# Altium schematic sheet atmel.SchDoc
size A4; SheetNumber: 3; SheetTotal: 5
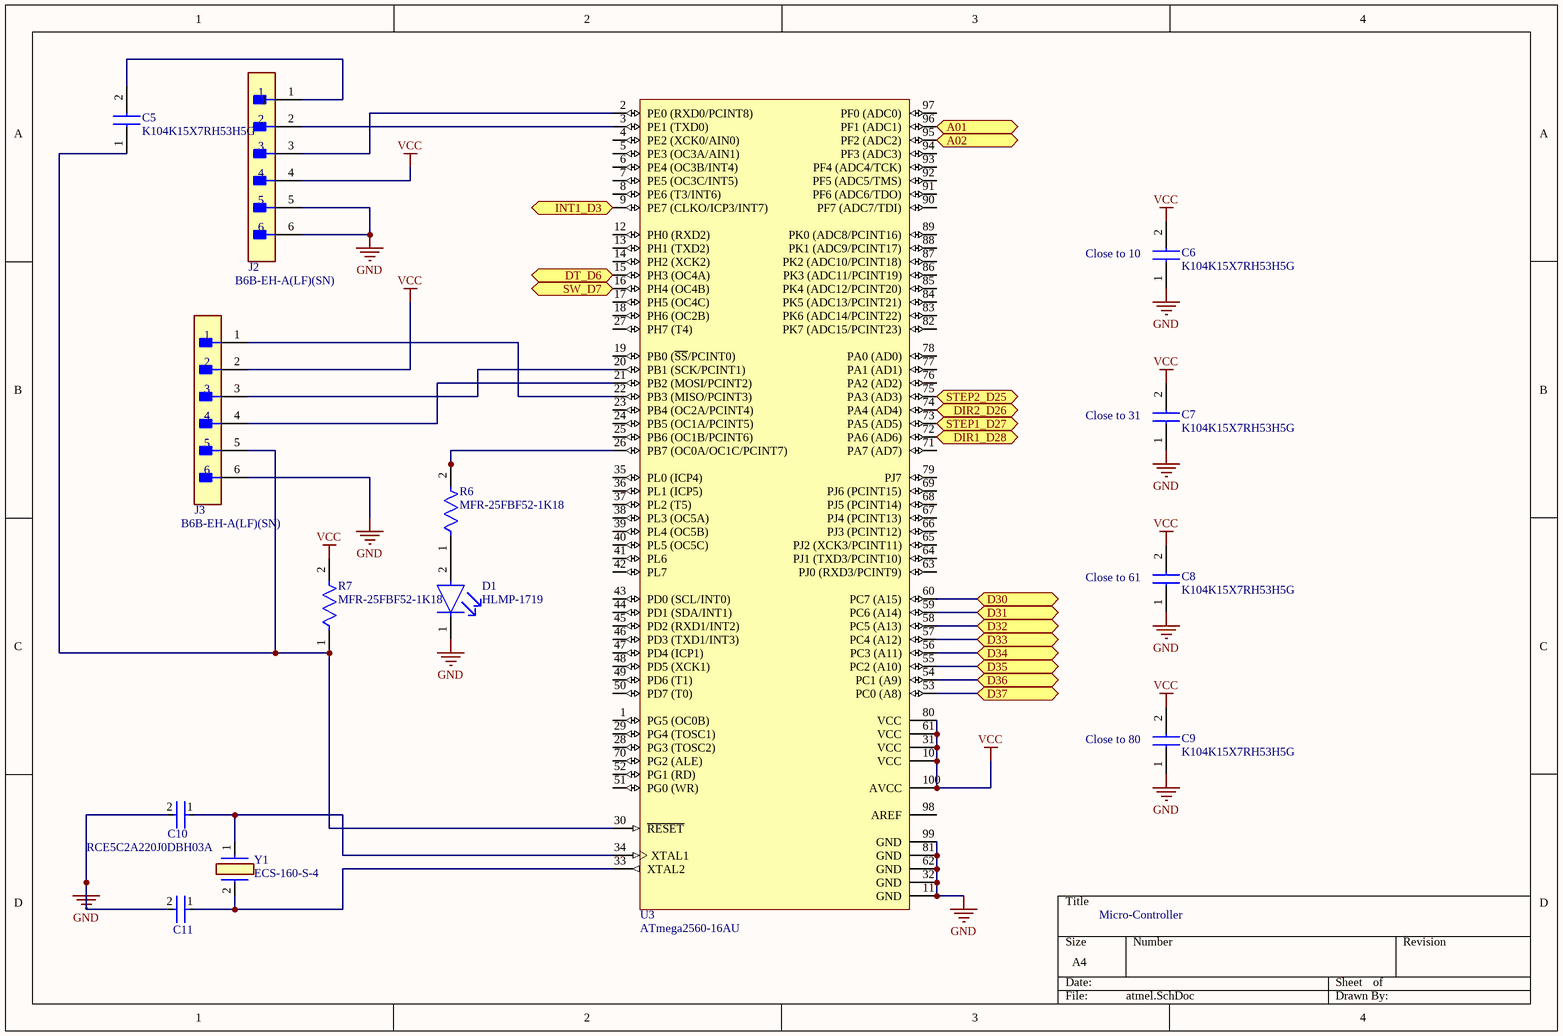
[diagram p0: atmel.SchDoc]

## Parts
C5  K104K15X7RH53H5G  [K104K15X7RH53H5G]
C6  K104K15X7RH53H5G  [K104K15X7RH53H5G]
C7  K104K15X7RH53H5G  [K104K15X7RH53H5G]
C8  K104K15X7RH53H5G  [K104K15X7RH53H5G]
C9  K104K15X7RH53H5G  [K104K15X7RH53H5G]
C10  RCE5C2A220J0DBH03A  [FP-RCE0DB-MFG]
C11  RCE5C2A220J0DBH03A  [FP-RCE0DB-MFG]  (value not drawn)
D1  HLMP-1719  [FP-HLMP-1719-MFG]
J2  B6B-EH-A(LF)(SN)  [FP-B6B-EH-A_LF_SN-MFG]
J3  B6B-EH-A(LF)(SN)  [FP-B6B-EH-A_LF_SN-MFG]
R6  MFR-25FBF52-1K18  [FP-MFR-25-MFG]
R7  MFR-25FBF52-1K18  [FP-MFR-25-MFG]
U3  ATmega2560-16AU  [100A_M]
Y1  ECS-160-S-4  [ECS160S4]

## Ports
A01 (bidir), A02 (bidir), D30 (bidir), D31 (bidir), D32 (bidir), D33 (bidir), D34 (bidir), D35 (bidir), D36 (bidir), D37 (bidir), DIR1_D28 (bidir), DIR2_D26 (bidir), DT_D6 (bidir), INT1_D3 (bidir), STEP1_D27 (bidir), STEP2_D25 (bidir), SW_D7 (bidir)

## Nets
GND: C6.1 C7.1 C8.1 C9.1 C10.2 C11.2 D1.1(C) J2.5 J2.6 J3.6 U3.11(GND) U3.32(GND) U3.62(GND) U3.81(GND) U3.99(GND)
VCC: C6.2 C7.2 C8.2 C9.2 J2.4 J3.2 R7.2 U3.10(VCC) U3.31(VCC) U3.61(VCC) U3.80(VCC) U3.100(AVCC)
A01: U3.96(PF1_(ADC1)) ; port A01
A02: U3.95(PF2_(ADC2)) ; port A02
D30: U3.60(PC7_(A15)) ; port D30
D31: U3.59(PC6_(A14)) ; port D31
D32: U3.58(PC5_(A13)) ; port D32
D33: U3.57(PC4_(A12)) ; port D33
D34: U3.56(PC3_(A11)) ; port D34
D35: U3.55(PC2_(A10)) ; port D35
D36: U3.54(PC1_(A9)) ; port D36
D37: U3.53(PC0_(A8)) ; port D37
DIR1_D28: U3.72(PA6_(AD6)) ; port DIR1_D28
DIR2_D26: U3.74(PA4_(AD4)) ; port DIR2_D26
DT_D6: U3.15(PH3_(OC4A)) ; port DT_D6
INT1_D3: U3.9(PE7_(CLKO/ICP3/INT7)) ; port INT1_D3
STEP1_D27: U3.73(PA5_(AD5)) ; port STEP1_D27
STEP2_D25: U3.75(PA3_(AD3)) ; port STEP2_D25
SW_D7: U3.16(PH4_(OC4B)) ; port SW_D7
NetC5_1: C5.1 J3.5 R7.1 U3.30(~{RESET})
NetC5_2: C5.2 J2.1
NetC10_1: C10.1 U3.34(XTAL1) Y1.1
NetC11_1: C11.1 U3.33(XTAL2) Y1.2
NetD1_2: D1.2(A) R6.1
NetJ2_2: J2.2 U3.3(PE1_(TXD0))
NetJ2_3: J2.3 U3.2(PE0_(RXD0/PCINT8))
NetJ3_1: J3.1 U3.22(PB3_(MISO/PCINT3))
NetJ3_3: J3.3 U3.20(PB1_(SCK/PCINT1))
NetJ3_4: J3.4 U3.21(PB2_(MOSI/PCINT2))
NetR6_2: R6.2 U3.26(PB7_(OC0A/OC1C/PCINT7))

Not connected (* = marked no-connect by the designer): U3 1(PG5_(OC0B)) 4(PE2_(XCK0/AIN0)) 5(PE3_(OC3A/AIN1)) 6(PE4_(OC3B/INT4)) 7(PE5_(OC3C/INT5)) 8(PE6_(T3/INT6)) 12(PH0_(RXD2)) 13(PH1_(TXD2)) 14(PH2_(XCK2)) 17(PH5_(OC4C)) 18(PH6_(OC2B)) 19(PB0_(~{SS}/PCINT0)) 23(PB4_(OC2A/PCINT4)) 24(PB5_(OC1A/PCINT5)) 25(PB6_(OC1B/PCINT6)) 27(PH7_(T4)) 28(PG3_(TOSC2)) 29(PG4_(TOSC1)) 35(PL0_(ICP4)) 36(PL1_(ICP5)) 37(PL2_(T5)) 38(PL3_(OC5A)) 39(PL4_(OC5B)) 40(PL5_(OC5C)) 41(PL6) 42(PL7) 43(PD0_(SCL/INT0)) 44(PD1_(SDA/INT1)) 45(PD2_(RXD1/INT2)) 46(PD3_(TXD1/INT3)) 47(PD4_(ICP1)) 48(PD5_(XCK1)) 49(PD6_(T1)) 50(PD7_(T0)) 51(PG0_(WR)) 52(PG1_(RD)) 63(PJ0_(RXD3/PCINT9)) 64(PJ1_(TXD3/PCINT10)) 65(PJ2_(XCK3/PCINT11)) 66(PJ3_(PCINT12)) 67(PJ4_(PCINT13)) 68(PJ5_(PCINT14)) 69(PJ6_(PCINT15)) 70(PG2_(ALE)) 71(PA7_(AD7)) 76(PA2_(AD2)) 77(PA1_(AD1)) 78(PA0_(AD0)) 79(PJ7) 82(PK7_(ADC15/PCINT23)) 83(PK6_(ADC14/PCINT22)) 84(PK5_(ADC13/PCINT21)) 85(PK4_(ADC12/PCINT20)) 86(PK3_(ADC11/PCINT19)) 87(PK2_(ADC10/PCINT18)) 88(PK1_(ADC9/PCINT17)) 89(PK0_(ADC8/PCINT16)) 90(PF7_(ADC7/TDI)) 91(PF6_(ADC6/TDO)) 92(PF5_(ADC5/TMS)) 93(PF4_(ADC4/TCK)) 94(PF3_(ADC3)) 97(PF0_(ADC0)) 98(AREF)

## Notes on the sheet
- (near C6) Close to 10
- (near C7) Close to 31
- (near C8) Close to 61
- (near C9) Close to 80
- Micro-Controller

## Library data of the parts
C5-C9 = K104K15X7RH53H5G: Capacitor; Manufacturer_Name: Vishay; Datasheet Link: https://www.vishay.com/docs/45250/kgseries.pdf; Height: 6.4mm; Manufacturer_Part_Number: K104K15X7RH53H5G; Mouser Part Number: 594-K104K15X7RH53H5G; Mouser Price/Stock: https://www.mouser.co.uk/ProductDetail/Vishay-BC-Components/K104K15X7RH53H5G?qs=DPoM0jnrROVmsAlOWkFXbA%3D%3D
C10 C11 = CMP-06035-047347-1: Cap Ceramic 22pF 100V C0G ±5% Radial 2.5mm +125°C Ammo Pack; Lead Diameter: 0.5mm; Lead/Base Style: Straight; Height: 3.5mm; Voltage: 100V; Mount: Through Hole; Min Operating Temperature: -55°C; Height - Seated (Max): 0.138inch; Dielectric: C0G; Width: 0.098inch; Depth: 2.5mm; Lead Pitch: 0.098inch; Packaging: Tape and Reel; Voltage Rating (DC): 100V; Capacitance: 22pF; Package Quantity: 2000; Max Operating Temperature: 125°C; Tolerance: 5%; Termination: Radial; Voltage Rating: 100V; Case/Package: Radial; Resistor Type: Ceramic; Length: 3.6mm; Ratings: AEC-Q200
D1 = CMP-2000-06410-2: LED YELLOW DIFFUSED T-1 T/H; Manufacturer: Broadcom; Wavelength: 585nm; Led Orientation: Straight; Luminous Intensity: 2.1mcd; Forward Voltage: 1.8V; Viewing Angle: 50°; Reverse Voltage: 5V; Power Dissipation: 17.5mW; Forward Current: 2mA; Lead Free: Yes; Automotive: No; Device Class L1: Optoelectronics; Mouser Description: Standard LEDs - Through Hole Yellow Diffused 585nm 2.1mcd; Digikey Description: LED YELLOW DIFFUSED T-1 T/H; Temperature: -40°C to +100°C; Temperature Range High: +100°C; Package: 0; Category: Diode; Colour: Yellow; Device Class L2: LEDs; ComponentLink2Description: Datasheet; ComponentLink2URL: https://docs.broadcom.com/docs/AV02-1557EN; Temperature Range Low: -40°C; Device Class L3: unset; Octopart: https://octopart.com/hlmp-1719-broadcom-71130405; RoHS: TRUE; Manufacturer Part Number: HLMP-1719
J2 J3 = CMP-17439-000293-1: CONN HEADER VERT 6POS 2.5MM; Voltage Rating: 250V; Number of Positions: 6; Current Rating: 3A; Mated Stacking Heights: 8.1mm; Gender: Male; Insulation Material: Nylon; Number of Contacts: 6; Contact Plating: Tin; Pitch: 2.5mm; Orientation: Straight; Insulation Color: Natural; Packaging: Bulk; Termination: Solder; Flammability Rating: UL94 V-0; Lead Free: Lead Free; Contact Mating Length: 0.13inch; Color: Natural; Contact Finish - Mating: TIN; Connector Type: Header; Contact Shape: Square; Contact Type: Male Pin; Series: EH; Contact Material: Brass; Fastening Type: Friction; Number of Rows: 1; Mount: Through Hole; Housing Color: White
R6 R7 = CMP-03413-000001-1: RES 1.18K OHM 1/4W 1% AXIAL; Manufacturer: Yageo; Value: 1.18kΩ; Temperature Coefficient: 100ppm/°C; Power Rating: 0.25W; Voltage Rating: 250V; Temperature: -55°C to +155°C; Automotive: No; Temperature Range High: +155°C; Mouser Description: Metal Film Resistors 1.18K OHM 1/4W 1%; Digikey Description: RES 1.18K OHM 1/4W 1% AXIAL; Lead Free: Yes; Tolerance: 1%; ComponentLink2Description: Datasheet; ComponentLink2URL: https://www.yageo.com/upload/media/product/products/datasheet/lr/Yageo_LR_MFR_1.pdf; Temperature Range Low: -55°C; Package: MFR-25; Ipc Land Pattern Name: RESAD1000W75L680D260; Composition: Metal Film; Category: Res; Octopart: https://octopart.com/mfr-25fbf52-1k18-yageo-56251681; Series: MFR; Device Class L2: Resistors; Height: 2.6mm; Resistance: 1.18kΩ; Device Class L3: Through-Hole Resistors; Manufacturer Part Number: MFR-25FBF52-1K18; RoHS: TRUE; Device Class L1: Passive Components
U3 = CMP-0095-00210-2: 8-bit AVR Microcontroller, 4.5-5.5V, 16MHz, 256KB Flash, 4KB EEPROM, 8KB SRAM, 86 GPIO pins, 100-pin TQFP, Industrial Grade (-40°C to 85°C), Pb-Free; PackageDescription: 100-Pin Thin Profile Plastic Quad Flat Pack (TQFP), 14 x 14 x 1.0 mm Body, 0.5 mm Pitch; ComponentLink1Description: Manufacturer URL; ComponentLink3URL: http://www.atmel.com/dyn/resources/prod_documents/2549S.pdf; RevisionNote: DatasheetVersion & PackageVersion updated. URLs added.; DatasheetVersion: revN, May-2011; ComponentLink2Description: ATmega640/1280/1281/2560/2561 Datasheet; PackageReference: 100A; PackageVersion: revD, Oct-2010; Code_JEDEC: MS-026-AED; ComponentLink1URL: http://www.atmel.com/; ComponentLink2URL: http://www.atmel.com/dyn/resources/prod_documents/doc2549.pdf; ComponentLink3Description: ATmega640/1280/1281/2560/2561 Summary
Y1 = ECS-160-S-4: Crystal or Oscillator; Manufacturer_Name: ECS; Datasheet Link: http://www.ecsxtal.com/store/pdf/hc_49us.pdf; Height: 3.5mm; Manufacturer_Part_Number: ECS-160-S-4; Mouser Part Number: 520-HCU1600-S; Mouser Price/Stock: https://www.mouser.co.uk/ProductDetail/ECS/ECS-160-S-4?qs=CNVyLAqdhH0J%2FZuif68kGw%3D%3D